# EAGLE design operator-interface-display-r1.1 (EAGLE 5.12)
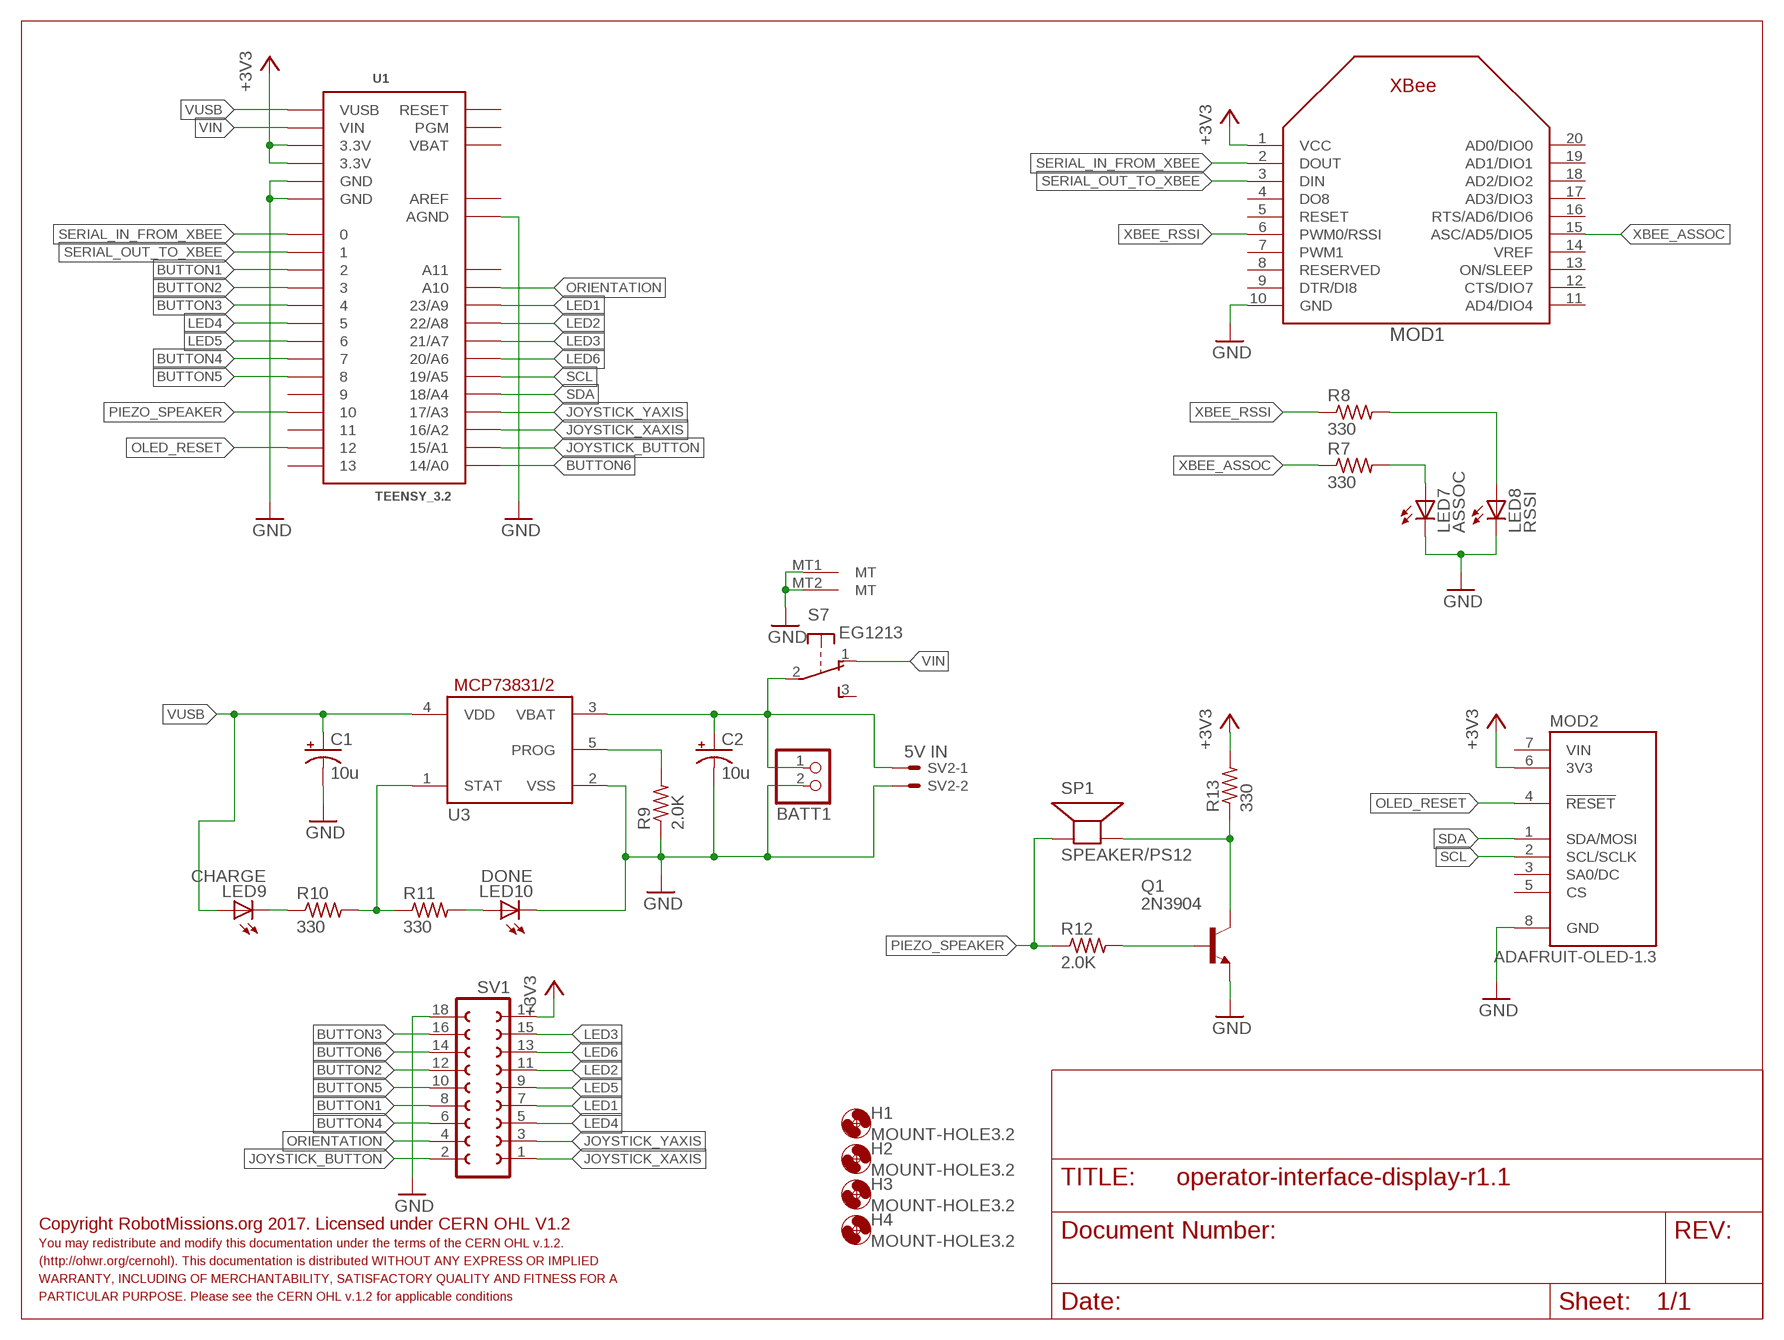
[diagram p0: schematic, sheet 1]

## Parts
BATT1  JST_2PIN-THM  [JST-PH-2-THM]
C1  10u  CPOL-USE2.5-6  [E2,5-6]
C2  10u  CPOL-USE2.5-6  [E2,5-6]
H1  MOUNT-HOLE3.2  [3,2]
H2  MOUNT-HOLE3.2  [3,2]
H3  MOUNT-HOLE3.2  [3,2]
H4  MOUNT-HOLE3.2  [3,2]
LED7  ASSOC  LED5MM  [LED5MM]
LED8  RSSI  LED5MM  [LED5MM]
LED9  CHARGE  LED5MM  [LED5MM]
LED10  DONE  LED5MM  [LED5MM]
MOD1  XBEE  [XBEE]
MOD2  ADAFRUIT-OLED-1.3  [ADAFRUIT-OLED-1.3]
Q1  2N3904  [TO92]
R7  330  R-US_0207/10  [0207/10]
R8  330  R-US_0207/10  [0207/10]
R9  2.0K  R-US_0207/2V  [0207/2V]
R10  330  R-US_0207/10  [0207/10]
R11  330  R-US_0207/10  [0207/10]
R12  2.0K  R-US_0207/10  [0207/10]
R13  330  R-US_0207/10  [0207/10]
S7  EG1213  [EG1213]
SP1  SPEAKER/PS12  [PS12]
SV1  FE09-2W  [FE09-2W]
SV2  5V IN  22-23-2021  [22-23-2021]
U1  TEENSY_3.2  TEENSY_3.0+4  [TEENSY_3.0+4]
U3  MCP73831/OT  [SOT23-5L]

## Nets
+3V3: MOD1.1(VCC) MOD2.6(3V3) R13.2 SV1.17 U1.3.3V U1.3.3V1(3.3V)
BUTTON1: SV1.8 U1.2
BUTTON2: SV1.12 U1.3
BUTTON3: SV1.16 U1.4
BUTTON4: SV1.6 U1.7
BUTTON5: SV1.10 U1.8
BUTTON6: SV1.14 U1.14/A0
GND: BATT1.2 C1.- C2.- LED7.K(C) LED8.K(C) LED10.K(C) MOD1.10(GND) MOD2.8(GND) Q1.3(E) R9.1 S7.MT1(MT) S7.MT2(MT) SV1.18 SV2.2 U1.AGND U1.GND U1.GND1(GND) U3.2(VSS)
JOYSTICK_BUTTON: SV1.2 U1.15/A1
JOYSTICK_XAXIS: SV1.1 U1.16/A2
JOYSTICK_YAXIS: SV1.3 U1.17/A3
LED1: SV1.7 U1.23/A9
LED2: SV1.11 U1.22/A8
LED3: SV1.15 U1.21/A7
LED4: SV1.5 U1.5
LED5: SV1.9 U1.6
LED6: SV1.13 U1.20/A6
N$1: LED8.A R8.2
N$2: LED7.A R7.2
N$5: Q1.1(C) R13.1 SP1.P$2(-)
N$6: Q1.2(B) R12.2
N$10: R9.2 U3.5(PROG)
N$11: LED9.K(C) R10.1
N$12: R10.2 R11.1 U3.1(STAT)
N$13: LED10.A R11.2
N$14: BATT1.1 C2.+ S7.2(P) SV2.1 U3.3(VBAT)
OLED_RESET: MOD2.4(!RESET) U1.12
ORIENTATION: SV1.4 U1.A10
PIEZO_SPEAKER: R12.1 SP1.P$1(+) U1.10
SCL: MOD2.2(SCL/SCLK) U1.19/A5
SDA: MOD2.1(SDA/MOSI) U1.18/A4
SERIAL_IN_FROM_XBEE: MOD1.2(DOUT) U1.0
SERIAL_OUT_TO_XBEE: MOD1.3(DIN) U1.1
VIN: S7.1(O) U1.VIN
VUSB: C1.+ LED9.A U1.VUSB U3.4(VDD)
XBEE_ASSOC: MOD1.15(ASC/AD5/DIO5) R7.1
XBEE_RSSI: MOD1.6(PWM0/RSSI) R8.1
Unconnected: MOD1.4(DO8) MOD1.5(RESET) MOD1.7(PWM1) MOD1.8(RESERVED) MOD1.9(DTR/DI8) MOD1.11(AD4/DIO4) MOD1.12(CTS/DIO7) MOD1.13(ON/SLEEP) MOD1.14(VREF) MOD1.16(RTS/AD6/DIO6) MOD1.17(AD3/DIO3) MOD1.18(AD2/DIO2) MOD1.19(AD1/DIO1) MOD1.20(AD0/DIO0) MOD2.3(SA0/DC) MOD2.5(CS) MOD2.7(VIN) S7.3(S) U1.9 U1.11 U1.13 U1.A11 U1.PGM U1.RESET

## Notes on the sheet
- Copyright RobotMissions.org 2017. Licensed under CERN OHL V1.2
- You may redistribute and modify this documentation under the terms of the CERN OHL v.1.2.
- (http://ohwr.org/cernohl). This documentation is distributed WITHOUT ANY EXPRESS OR IMPLIED
- WARRANTY, INCLUDING OF MERCHANTABILITY, SATISFACTORY QUALITY AND FITNESS FOR A
- PARTICULAR PURPOSE. Please see the CERN OHL v.1.2 for applicable conditions

## Power pins joined to a net without a drawn wire
AREF: U1.AREF
VBAT: U1.VBAT

## Library data of the parts
BATT1 = adafruit:JST_2PIN: JST 2-Pin Connectors of various flavors SMT-RA (S2B-PH-SM4) 4UConnector #17311 SMT (B2B-PH-SM4) THM-RA (S2B-PH) THM (B2B-PH)
C1 C2 = rcl:CPOL-US: POLARIZED CAPACITOR, American symbol
H1-H4 = holes:MOUNT-HOLE: MOUNTING HOLE with drill center marker
LED7-LED10 = led:LED: LED OSRAM: - CHIPLED LG R971, LG N971, LY N971, LG Q971, LY Q971, LO R971, LY R971 LH N974, LH R974 LS Q976, LO Q976, LY Q976 LO Q996 - Hyper CHIPLED LW Q18S LB Q993, LB Q99A, LB R99A - SideLED LS A670, LO A670, LY A670, LG A670, LP A670 LB A673, LV A673, LT A673, LW A673 LH A674 LY A675 LS A676, LA A676, LO A676, LY A676, LW A676 LS A679, LY A679, LG A679 - Hyper Micro SIDELED® LS Y876, LA Y876, LO Y876, LY Y876 LT Y87S - SmartLED LW L88C, LW L88S LB L89C, LB L89S, LG L890 LS L89K, LO L89K, LY L89K LS L896, LA L896, LO L896, LY L896 - TOPLED LS T670, LO T670, LY T670, LG T670, LP T670 LSG T670, LSP T670, LSY T670, LOP T670, LYG T670 LG T671, LOG T671, LSG T671 LB T673, LV T673, LT T673, LW T673 LH T674 LS T676, LA T676, LO T676, LY T676, LB T676, LH T676, LSB T676, LW T676 LB T67C, LV T67C, LT T67C, LS T67K, LO T67K, LY T67K, LW E67C LS E67B, LA E67B, LO E67B, LY E67B, LB E67C, LV E67C, LT E67C LW T67C LS T679, LY T679, LG T679 LS T770, LO T770, LY T770, LG T770, LP T770 LB T773, LV T773, LT T773, LW T773 LH T774 LS E675, LA E675, LY E675, LS T675 LS T776, LA T776, LO T776, LY T776, LB T776 LHGB T686 LT T68C, LB T68C - Hyper Mini TOPLED® LB M676 - Mini TOPLED Santana® LG M470 LS M47K, LO M47K, LY M47K Source: http://www.osram.convergy.de LUXEON: - LUMILED® LXK2-PW12-R00, LXK2-PW12-S00, LXK2-PW14-U00, LXK2-PW14-V00 LXK2-PM12-R00, LXK2-PM12-S00, LXK2-PM14-U00 LXK2-PE12-Q00, LXK2-PE12-R00, LXK2-PE12-S00, LXK2-PE14-T00, LXK2-PE14-U00 LXK2-PB12-K00, LXK2-PB12-L00, LXK2-PB12-M00, LXK2-PB14-N00, LXK2-PB14-P00, LXK2-PB14-Q00 LXK2-PR12-L00, LXK2-PR12-M00, LXK2-PR14-Q00, LXK2-PR14-R00 LXK2-PD12-Q00, LXK2-PD12-R00, LXK2-PD12-S00 LXK2-PH12-R00, LXK2-PH12-S00 LXK2-PL12-P00, LXK2-PL12-Q00, LXK2-PL12-R00 Source: www.luxeon.com KINGBRIGHT: KA-3528ASYC Source: www.kingbright.com
MOD1 = adafruit:XBEE
MOD2 = oled:ADAFRUIT-OLED-1.3
Q1 = transistor-npn:2N3904: NPN Transistor
R7-R13 = rcl:R-US_: RESISTOR, American symbol
S7 = oled:EG1213: E-Switch right-angle slide SPDT Part #EG1213 http://www.ladyada.net/library/eagle
SP1 = adafruit:SPEAKER: SPEAKER Source: Buerklin Added PS12 (for part # PS1240 piezo) http://www.ladyada.net/library/pcb/eaglelibrary.html
SV1 = con-lsta:FE09-2W: FEMALE HEADER; OC_FARNELL: unknown; OC_NEWARK: unknown
SV2 = con-molex:22-23-2021: .100" (2.54mm) Center Header - 2 Pin; MF: MOLEX; MPN: 22-23-2021; OC_FARNELL: 1462926; OC_NEWARK: 25C3832
U1 = Teensy3.0-5.12:TEENSY_3.0+4: Teensy 3.0 board, showing all pins that are easily acessible. See 'AllAnalogPins" and 'AllPins' packages for additional pin holes, as needed. The 'Basic' package has fewer pins.
U3 = adafruit:MCP73831: MCP73831/2 Miniature Single-Cell, Fully Integrated Li-Ion, Li-Polymer Charge Management Controllers. Nice and small simple lipoly charge controller, with adjustable current and status output (LED) http://www.ladyada.net/library/pcb/eaglelibrary.html

## Board
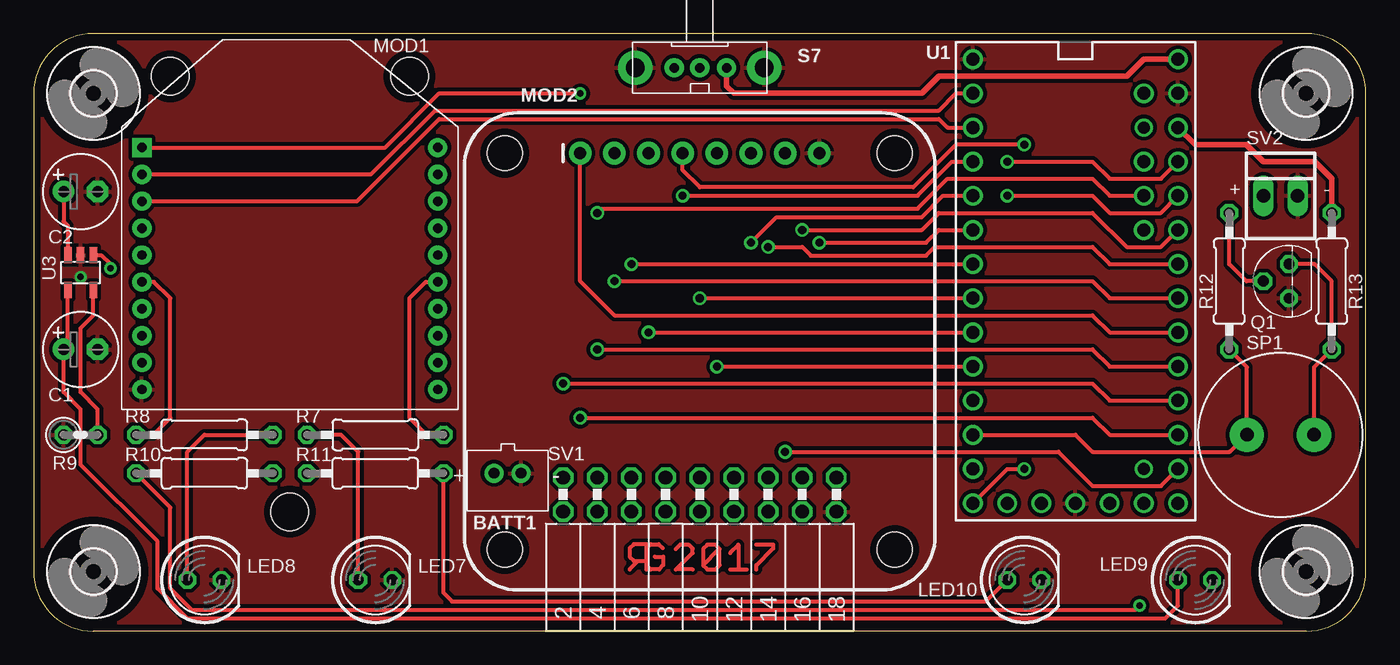
[diagram p1: board, top side]
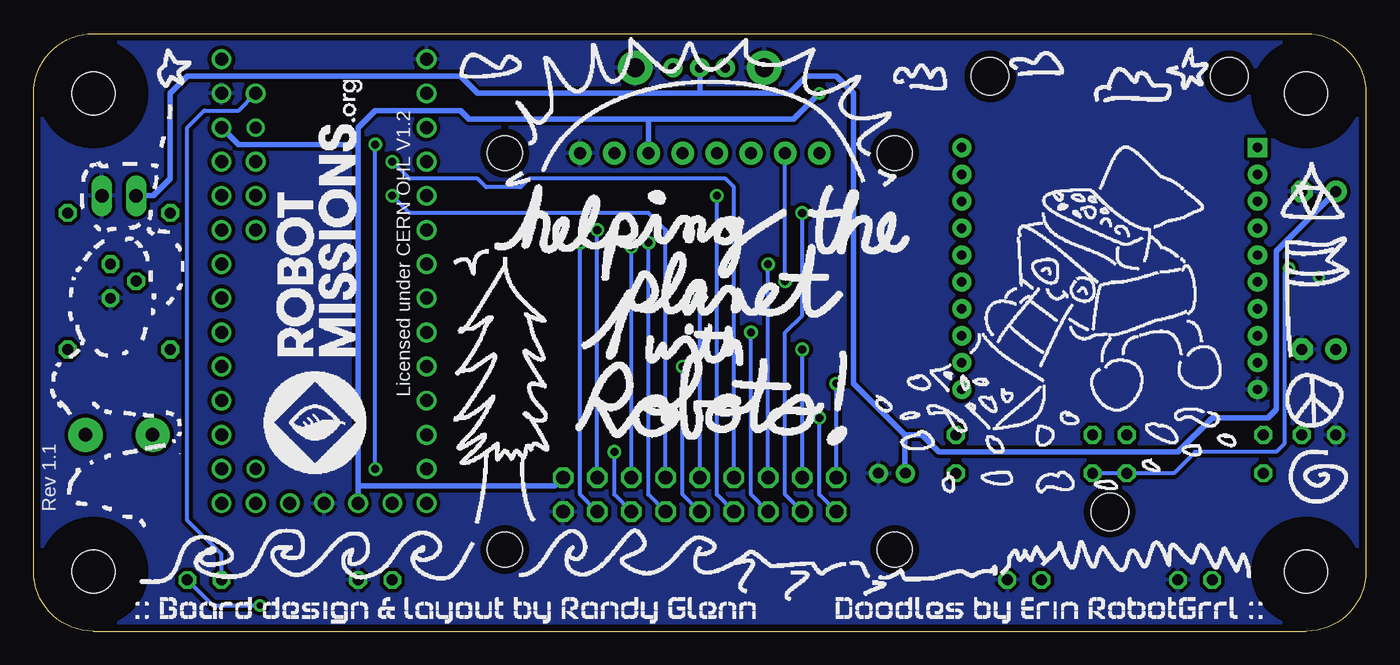
[diagram p2: board, bottom side, seen from below]

Size 99.06 x 44.45 mm. Coordinates in mm from the lower left corner, seen from the top.
Outline: 94.62,0 arc90 99.06,4.44 99.06,40 arc90 94.62,44.45 4.45,44.45 arc90 0,40 0,4.44 arc90 4.45,0 94.62,0
Copper layers (1*16): Top 0.035mm / dielectric 1.5mm / Bottom 0.035mm
Design rules "default *": minimum track width 10mil, minimum drill 0.5mm, track to track 11mil, track to pad 11mil, pad to pad 11mil, via to via 11mil, smd to smd 11mil, copper to edge 20mil, drill to drill 8mil, minimum pad ring 10mil, minimum via ring 8mil, stop-mask expansion 4mil, vias tented up to drill 25mil, thermal gap 10mil
Holes 2.8 mm at 10.16,41.28 27.94,41.28 19.05,8.89

### Footprints (pad centres in the part's own frame; a part is rotated, then mirrored left to right if it is on the bottom)
JST-PH-2-THM = drill 0.8 pad 1.422 round: 1 1,0; 2 -1,0
E2,5-6 = drill 0.813 pad 1.6 round: + -1.27,0 | drill 0.813 pad 1.6 octagon: - 1.27,0
3,2 = hole 3.2: 0,0
LED5MM = drill 0.813 octagon: A -1.27,0; K 1.27,0
XBEE = drill 0.7 pad 1.422 square: 1 -11,5.5 | drill 0.7 pad 1.422 round: 2 -11,3.5; 3 -11,1.5; 4 -11,-0.5; 5 -11,-2.5; 6 -11,-4.5; 7 -11,-6.5; 8 -11,-8.5; 9 -11,-10.5; 10 -11,-12.5; 11 11,-12.5; 12 11,-10.5; 13 11,-8.5; 14 11,-6.5; 15 11,-4.5; 16 11,-2.5; 17 11,-0.5; 18 11,1.5; 19 11,3.5; 20 11,5.5
ADAFRUIT-OLED-1.3 = drill 0.9 pad 1.676 round: 1 -8.89,0; 2 -6.35,0; 3 -3.81,0; 4 -1.27,0; 5 1.27,0; 6 3.81,0; 7 6.35,0; 8 8.89,0 | hole 2.6: -14.5,0; 14.5,0; -14.5,-29.5; 14.5,-29.5
TO92 = drill 0.813 octagon: 1 1.27,0; 2 0,1.905; 3 -1.27,0
0207/10 = drill 0.813 octagon: 1 -5.08,0; 2 5.08,0
0207/2V = drill 0.813 octagon: 1 -1.27,0; 2 1.27,0
EG1213 = drill 0.7 pad 1.422 round: 1 -2,0; 2 0,0; 3 1.9,0 | drill 1.4 pad 2.54 round: MT1 -4.8,0; MT2 4.8,0
PS12 = drill 1 pad 2.54 round: P$1 -2.5,0; P$2 2.5,0
FE09-2W = drill 1.016 octagon: 1 -10.16,1.27; 2 -10.16,-1.27; 3 -7.62,1.27; 4 -7.62,-1.27; 5 -5.08,1.27; 6 -5.08,-1.27; 7 -2.54,1.27; 8 -2.54,-1.27; 9 0,1.27; 10 0,-1.27; 11 2.54,1.27; 12 2.54,-1.27; 13 5.08,1.27; 14 5.08,-1.27; 15 7.62,1.27; 16 7.62,-1.27; 17 10.16,1.27; 18 10.16,-1.27
22-23-2021 = drill 1 long: 1 -1.27,0; 2 1.27,0
TEENSY_3.0+4 = drill 0.965 round: 0 -7.62,13.97; 1 -7.62,11.43; 2 -7.62,8.89; 3 -7.62,6.35; 3.3V 7.62,11.43; 3.3V1 -2.54,-16.51; 4 -7.62,3.81; 5 -7.62,1.27; 6 -7.62,-1.27; 7 -7.62,-3.81; 8 -7.62,-6.35; 9 -7.62,-8.89; 10 -7.62,-11.43; 11 -7.62,-13.97; 12 -7.62,-16.51; 13 7.62,-16.51; 14/A0 7.62,-13.97; 15/A1 7.62,-11.43; 16/A2 7.62,-8.89; 17/A3 7.62,-6.35; 18/A4 7.62,-3.81; 19/A5 7.62,-1.27; 20/A6 7.62,1.27; 21/A7 7.62,3.81; 22/A8 7.62,6.35; 23/A9 7.62,8.89; A10 5.08,6.35; A11 5.08,3.81; AGND 7.62,13.97; AREF 5.08,8.89; GND -7.62,16.51; GND1 0,-16.51; PGM 2.54,-16.51; RESET 5.08,-16.51; VBAT -5.08,-16.51; VIN 7.62,16.51; VUSB 5.08,13.97
SOT23-5L = smd 0.55 x 1.2: 1 -0.95,-1.3; 2 0,-1.3; 3 0.95,-1.3; 4 0.95,1.3; 5 -0.95,1.3

### Placement (x,y rotation side)
BATT1  35.24,11.75 180 top
C1  3.49,20.95 0 top
C2  3.49,32.7 0 top
H1  4.45,40 0 top
H2  94.62,40 0 top
H3  94.62,4.44 0 top
H4  4.45,4.44 0 top
LED7  25.4,3.81 0 top
LED8  12.7,3.81 0 top
LED9  86.36,3.81 0 top
LED10  73.66,3.81 0 top
MOD1  19.05,30.48 0 top
MOD2  49.53,35.56 0 top
Q1  93.34,26.03 90 top
R7  25.4,14.61 180 top
R8  12.7,14.61 0 top
R9  3.49,14.61 0 top
R10  12.7,11.75 0 top
R11  25.4,11.75 0 top
R12  88.9,26.03 90 top
R13  96.52,26.03 90 top
S7  49.53,41.91 180 top
SP1  92.71,14.61 0 top
SV1  49.53,10.16 0 top
SV2  92.71,32.38 0 top
U1  77.47,26.03 0 top
U3  3.49,26.67 180 top
U$1  [TOP-ART-DISPLAY-1.1]  1.27,0.64 0 top
U$2  [RGLOGO_SMALL_2017]  45.72,4.44 0 top
U$3  [BOTTOM-ART-DISPLAY-1.1]  97.79,0.64 0 bottom
U$4  [OSHW_FILLX150_NOTEXT]  36.83,22.22 0 bottom

### Tracks (layer width: path | path; a pad name or v marks a point on that pad's centre or on a via)
+3V3  (via drill 0.5)
  Top 0.305: v40.64,40 30.16,40 26.14,35.98 MOD1.1
  Top 0.406: R13.2 96.52,33.66 95.25,34.93 91.44,34.93 90.17,36.19 86.36,36.19 U1.3.3V
  Bottom 0.406: 74.93,10.8 U1.3.3V1 | 53.34,38.1 66.67,38.1 67.31,38.73 73.66,38.73 74.93,37.47 74.93,36.19 | 53.34,38.1 MOD2.6 | MOD1.1 8.05,35.99 | 74.93,36.19 74.93,10.8 | 74.93,10.8 60.33,10.8 SV1.17 | U1.3.3V 83.82,36.19 74.93,36.19 | 53.34,38.1 42.55,38.1 v40.64,40
BUTTON1  (via drill 0.6)
  Top 0.305: v48.26,32.38 65.72,32.38 68.26,34.93 U1.2
  Bottom 0.305: v48.26,32.38 48.26,10.16 SV1.8
BUTTON2  (via drill 0.6)
  Top 0.305: U1.3 67.63,32.38 66.04,30.8 55.25,30.8 v53.34,28.89
  Bottom 0.305: v53.34,28.89 53.34,10.16 SV1.12
BUTTON3  (via drill 0.6)
  Top 0.305: v58.42,28.89 66.36,28.89 67.31,29.84 U1.4
  Bottom 0.305: SV1.16 58.42,10.16 v58.42,28.89
BUTTON4  (via drill 0.6)
  Top 0.305: v45.72,22.22 U1.7
  Bottom 0.305: v45.72,22.22 45.72,10.16 SV1.6
BUTTON5  (via drill 0.6)
  Top 0.305: v50.8,19.69 U1.8
  Bottom 0.305: v50.8,19.69 50.8,10.16 SV1.10
BUTTON6  (via drill 0.6)
  Top 0.305: U1.14/A0 83.82,10.8 78.74,10.8 76.2,13.33 v55.88,13.33
  Bottom 0.305: v55.88,13.33 55.88,10.16 SV1.14
GND  (via drill 0.5)
  other vias: 3.49,26.35
  pour Bottom: -1.27,44.45 -1.27,0 100.33,0 100.33,44.45
  pour Top: -1.27,44.45 -1.27,0 100.33,0 100.33,44.45
JOYSTICK_BUTTON  (via drill 0.6)
  Top 0.305: v40.64,15.88 78.74,15.88 80.01,14.61 U1.15/A1
  Bottom 0.305: v40.64,15.88 40.64,10.16 SV1.2
JOYSTICK_XAXIS  (via drill 0.6)
  Top 0.305: U1.16/A2 80.01,17.14 78.74,18.41 v39.37,18.41
  Bottom 0.305: SV1.1 v39.37,18.41
JOYSTICK_YAXIS  (via drill 0.6)
  Top 0.305: U1.17/A3 80.01,19.69 78.74,20.95 v41.91,20.95
  Bottom 0.305: SV1.3 v41.91,20.95
LED1  (via drill 0.6)
  Top 0.305: U1.23/A9 83.82,33.66 80.01,33.66 78.74,34.93 v72.39,34.93
  Bottom 0.305: SV1.7 46.99,33.02 47.62,33.66 62.23,33.66 62.87,33.02 65.41,33.02 66.04,33.66 71.12,33.66 v72.39,34.93
LED2  (via drill 0.6)
  Top 0.305: U1.22/A8 83.82,31.12 80.01,31.12 78.74,32.38 v72.39,32.38
  Bottom 0.305: SV1.11 52.07,29.84 53.34,31.12 71.12,31.12 v72.39,32.38
LED3  (via drill 0.6)
  Top 0.305: v57.15,29.84 66.04,29.84 67.31,31.12 78.74,31.12 81.28,28.58 83.82,28.58 U1.21/A7
  Bottom 0.305: SV1.15 v57.15,29.84
LED4  (via drill 0.6)
  Top 0.305: v44.45,27.3 U1.5
  Bottom 0.305: SV1.5 v44.45,27.3
LED5  (via drill 0.6)
  Top 0.305: v49.53,24.77 U1.6
  Bottom 0.305: SV1.9 v49.53,24.77
LED6  (via drill 0.6)
  Top 0.305: v54.61,28.58 57.15,28.58 57.79,27.94 66.36,27.94 66.99,28.58 78.74,28.58 80.01,27.3 U1.20/A6
  Bottom 0.305: SV1.13 v54.61,28.58
N$1
  Top 0.305: LED8.A 11.43,13.33 12.7,14.61 R8.2
N$2
  Top 0.305: LED7.A 24.13,13.33 22.86,14.61 R7.2
N$3  (via drill 0.9)
  other vias: 82.55,37.47
N$4  (via drill 0.9)
  other vias: 82.55,12.06
N$5
  Top 0.305: SP1.P$2 95.21,19.64 R13.1 96.52,26.03 95.25,27.3 Q1.1
N$6
  Top 0.305: R12.2 88.9,27.3 90.17,26.03 Q1.2
N$10
  Top 0.305: U3.5 4.44,23.49 3.49,22.54 3.49,17.78 4.76,16.51 R9.2
N$11  (via drill 0.5)
  Top 0.305: v82.23,1.91 81.91,1.59 11.75,1.59 10.16,3.17 10.16,9.21 R10.1
  Bottom 0.305: v82.23,1.91 85.72,1.91 LED9.K
N$12  (via drill 0.5)
  Top 0.305: v5.72,26.99 5.72,27.3 5.08,27.94 4.47,27.94 U3.1
  Bottom 0.305: R11.1 R10.2 14.29,11.75 12.7,13.33 6.67,13.33 6.03,13.97 6.03,26.67 v5.72,26.99
N$13
  Top 0.305: R11.2 30.48,2.86 31.12,2.22 70.8,2.22 LED10.A
N$14
  Top 0.305: U3.3 2.54,30.16 2.22,30.48 C2.+
  Bottom 0.406: 49.53,40 42.86,40 41.59,41.28 39.37,41.28 38.1,40 38.1,18.41 34.29,14.61 | 34.29,14.61 34.29,12.75 BATT1.1 | 34.29,14.61 33.02,14.61 31.75,13.33 13.97,13.33 11.43,15.88 7.3,15.88 6.67,16.51 6.67,28.26 C2.+ | SV2.1 90.17,32.38 88.9,33.66 88.9,40 87.63,41.28 67.31,41.28 66.04,40 49.53,40 | 49.53,40 S7.2
OLED_RESET  (via drill 0.6)
  Top 0.305: MOD2.4 48.26,34.29 49.53,33.02 65.41,33.02 68.58,36.19 v73.66,36.19 | v73.66,12.06 72.39,12.06 U1.12
  Bottom 0.305: v73.66,12.06 v73.66,36.19
ORIENTATION  (via drill 0.6)
  Top 0.305: v41.91,31.12 42.23,31.43 65.72,31.43 67.94,33.66 78.74,33.66 80.01,32.38 U1.A10
  Bottom 0.305: v41.91,31.12 41.91,23.5 43.18,22.22 43.18,10.16 SV1.4
PIEZO_SPEAKER
  Top 0.305: U1.10 77.47,14.61 78.74,13.33 88.94,13.33 SP1.P$1 90.21,19.64 R12.1
SCL  (via drill 0.6)
  Top 0.305: U1.19/A5 80.01,24.77 78.74,26.03 v43.18,26.03
  Bottom 0.305: v43.18,26.03 MOD2.2
SDA
  Top 0.305: U1.18/A4 80.01,22.22 78.74,23.5 43.18,23.5 40.64,26.03 MOD2.1
SERIAL_IN_FROM_XBEE
  Top 0.305: U1.0 68.58,40 67.31,38.73 29.85,38.73 25.09,33.98 MOD1.2
SERIAL_OUT_TO_XBEE
  Top 0.305: MOD1.3 24.04,31.98 30.16,38.1 67.31,38.1 67.94,37.47 U1.1
VIN
  Top 0.406: S7.1 51.53,40.54 52.07,40 66.04,40 67.31,41.28 81.28,41.28 82.55,42.54 U1.VIN
VUSB
  Top 0.305: LED9.A 85.09,1.91 84.14,0.95 11.43,0.95 9.21,3.17 9.21,6.67 3.49,12.38 3.49,16.51 2.22,17.78 C1.+ 2.54,21.28 U3.4
  Bottom 0.305: U1.VUSB 83.82,38.73 86.36,38.73 87.63,37.47 87.63,8.25 85.09,5.72 LED9.A
XBEE_ASSOC
  Top 0.305: MOD1.15 29.16,25.98 27.94,24.77 27.94,15.88 29.21,14.61 R7.1
XBEE_RSSI
  Top 0.305: MOD1.6 8.95,25.98 10.16,24.77 10.16,15.88 8.89,14.61 R8.1

### Text on the board
tNames: + | -
bNames: Licensed under CERN OHL V1.2 | Rev 1.1